# Altium schematic sheet Sheet1.SchDoc
size B; SheetNumber: 1
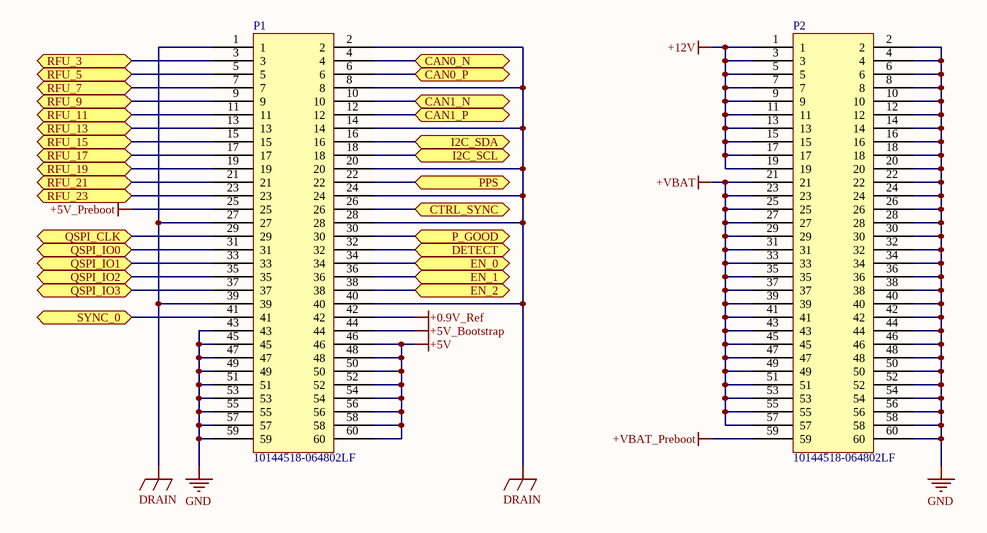
[diagram p0: Sheet1.SchDoc]

## Parts
P1  10144518-064802LF  [10144518-064802LF]
P2  10144518-064802LF  [10144518-064802LF]

## Ports
CAN0_N (bidir), CAN0_P (bidir), CAN1_N (bidir), CAN1_P (bidir), CTRL_SYNC (bidir), DETECT (bidir), EN_0 (bidir), EN_1 (bidir), EN_2 (bidir), I2C_SCL (bidir), I2C_SDA (bidir), P_GOOD (bidir), PPS (bidir), QSPI_CLK (bidir), QSPI_IO0 (bidir), QSPI_IO1 (bidir), QSPI_IO2 (bidir), QSPI_IO3 (bidir), RFU_3 (bidir), RFU_5 (bidir), RFU_7 (bidir), RFU_9 (bidir), RFU_11 (bidir), RFU_13 (bidir), RFU_15 (bidir), RFU_17 (bidir), RFU_19 (bidir), RFU_21 (bidir), RFU_23 (bidir), SYNC_0 (bidir)

## Nets
+0.9V_Ref: P1.42
+5V: P1.46 P1.48 P1.50 P1.52 P1.54 P1.56 P1.58 P1.60
+5V_Bootstrap: P1.44
+5V_Preboot: P1.25
+12V: P2.1 P2.3 P2.5 P2.7 P2.9 P2.11 P2.13 P2.15 P2.17 P2.19
+VBAT: P2.21 P2.23 P2.25 P2.27 P2.29 P2.31 P2.33 P2.35 P2.37 P2.39 P2.41 P2.43 P2.45 P2.47 P2.49 P2.51 P2.53 P2.55 P2.57
+VBAT_Preboot: P2.59
DRAIN: P1.1 P1.2 P1.8 P1.14 P1.20 P1.24 P1.27 P1.28 P1.39 P1.40
GND: P1.43 P1.45 P1.47 P1.49 P1.51 P1.53 P1.55 P1.57 P1.59 P2.2 P2.4 P2.6 P2.8 P2.10 P2.12 P2.14 P2.16 P2.18 P2.20 P2.22 P2.24 P2.26 P2.28 P2.30 P2.32 P2.34 P2.36 P2.38 P2.40 P2.42 P2.44 P2.46 P2.48 P2.50 P2.52 P2.54 P2.56 P2.58 P2.60
CAN0_N: P1.4 ; port CAN0_N
CAN0_P: P1.6 ; port CAN0_P
CAN1_N: P1.10 ; port CAN1_N
CAN1_P: P1.12 ; port CAN1_P
CTRL_SYNC: P1.26 ; port CTRL_SYNC
DETECT: P1.32 ; port DETECT
EN_0: P1.34 ; port EN_0
EN_1: P1.36 ; port EN_1
EN_2: P1.38 ; port EN_2
I2C_SCL: P1.18 ; port I2C_SCL
I2C_SDA: P1.16 ; port I2C_SDA
P_GOOD: P1.30 ; port P_GOOD
PPS: P1.22 ; port PPS
QSPI_CLK: P1.29 ; port QSPI_CLK
QSPI_IO0: P1.31 ; port QSPI_IO0
QSPI_IO1: P1.33 ; port QSPI_IO1
QSPI_IO2: P1.35 ; port QSPI_IO2
QSPI_IO3: P1.37 ; port QSPI_IO3
RFU_3: P1.3 ; port RFU_3
RFU_5: P1.5 ; port RFU_5
RFU_7: P1.7 ; port RFU_7
RFU_9: P1.9 ; port RFU_9
RFU_11: P1.11 ; port RFU_11
RFU_13: P1.13 ; port RFU_13
RFU_15: P1.15 ; port RFU_15
RFU_17: P1.17 ; port RFU_17
RFU_19: P1.19 ; port RFU_19
RFU_21: P1.21 ; port RFU_21
RFU_23: P1.23 ; port RFU_23
SYNC_0: P1.41 ; port SYNC_0

## Notes on the sheet
- Let's Build Rocket's Inc. Modular Paylaod System Based on TMP-010 Rev
  For more information visit https://github.com/LetsBuildRockets/Modular-Payload-System
  This work is licensed under CC BY-NC 4.0. To view a copy of this license, visit https://creativecommons.org/licenses/by-nc/4.0
- Title
- Size:
- Date:
- Assembly Variant:
- B
- Number:
- Time:
- Revision:
- Sheet
- of
- Author:
- File:

## Library data of the parts
P1 P2 = 10144518-064802LF: Unit Price (USD): 1.52